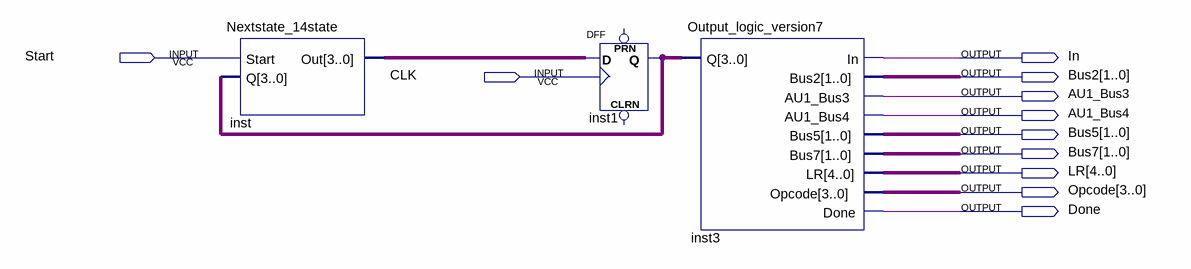
[diagram p0: schematic sheet]
// Quartus schematic Controller_version7.bdf as structural Verilog: 3 symbols, 11 pins
module Controller_version7 (
  input  Start,
  input  CLK,
  output In,
  output [1:0] Bus2,
  output AU1_Bus3,
  output AU1_Bus4,
  output [1:0] Bus5,
  output [1:0] Bus7,
  output [4:0] LR,
  output [3:0] Opcode,
  output Done
);

  wire [3:0] inst1_q, inst_out;

  Nextstate_14state inst (.Start(Start), .Q(inst1_q), .Out(inst_out));
  DFF inst1[3:0] (.CLK(CLK), .D(inst_out), .Q(inst1_q));  // open: CLRN, PRN
  Output_logic_version7 inst3 (
    .Q(inst1_q), .In(In), .Bus2(Bus2), .AU1_Bus3(AU1_Bus3), .AU1_Bus4(AU1_Bus4), .Bus5(Bus5), .Bus7(Bus7),
    .LR(LR), .Opcode(Opcode), .Done(Done));
endmodule
